# Altium schematic sheet CON_MC_XMC_J13_64PIN.SchDoc
size A4
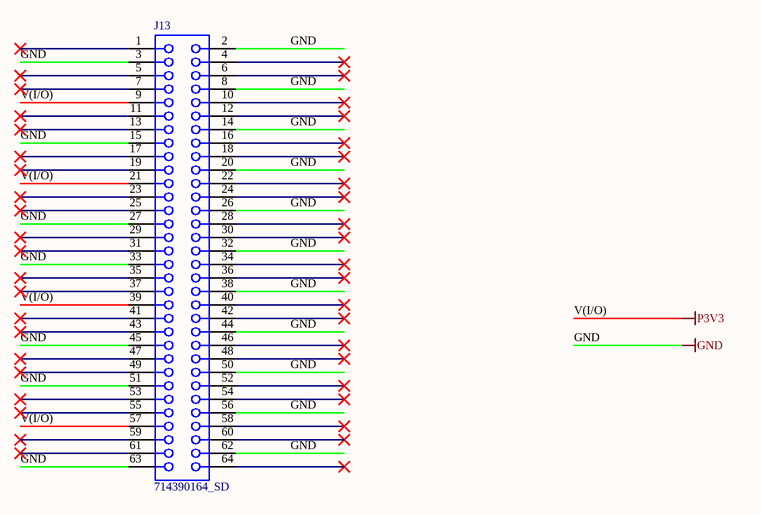
[diagram p0: CON_MC_XMC_J13_64PIN.SchDoc]

## Parts
J13  714390164_SD  [BTB1-2V64F]

## Nets
GND: J13.2 J13.3 J13.8 J13.14 J13.15 J13.20 J13.26 J13.27 J13.32 J13.33 J13.38 J13.44 J13.45 J13.50 J13.51 J13.56 J13.62 J13.63
V(I/O): J13.9 J13.21 J13.39 J13.57  [also labelled P3V3]

Not connected (* = marked no-connect by the designer): J13 1* 4* 5* 6* 7* 10* 11* 12* 13* 16* 17* 18* 19* 22* 23* 24* 25* 28* 29* 30* 31* 34* 35* 36* 37* 40* 41* 42* 43* 46* 47* 48* 49* 52* 53* 54* 55* 58* 59* 60* 61* 64*

## Library data of the parts
J13 = CMP-0001-00081-1: Board-to-Board Connector, Vertical, 2-Row, Pitch 1mm, 64-Position, Female; Mating Connector: Molex-714360164; ClassName: Board Template Connector; Datasheet Version: Apr-2006; Package Reference: BTB1-2V64F; Publisher: Altium; Component Kind: Standard